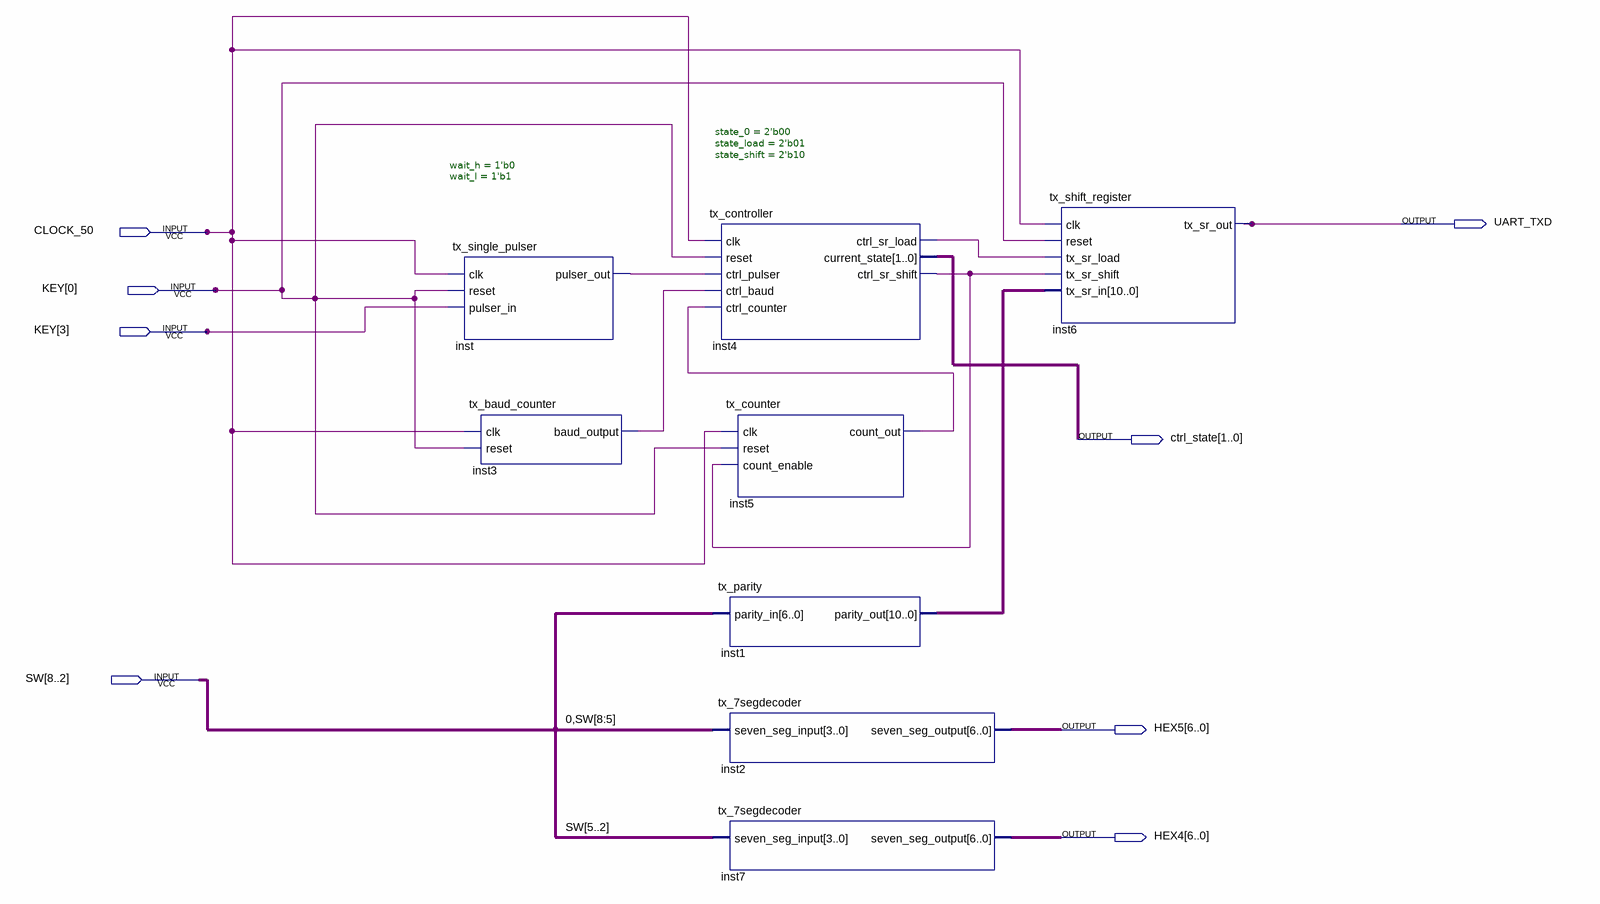
[diagram p0: schematic sheet]
// Quartus schematic tx_uart.bdf as structural Verilog: 8 symbols, 8 pins
module tx_uart (
  input  CLOCK_50,
  input  [3:0] KEY,
  input  [8:2] SW,
  output UART_TXD,
  output [1:0] ctrl_state,
  output [6:0] HEX5,
  output [6:0] HEX4
);

  wire \0 , inst3_baud_output, inst4_ctrl_sr_load, inst4_ctrl_sr_shift, inst5_count_out, inst_pulser_out;
  wire [10:0] inst1_parity_out;

  tx_single_pulser #(.wait_h(1'b0), .wait_l(1'b1)) inst (
    .clk(CLOCK_50), .reset(KEY[0]), .pulser_in(KEY[3]), .pulser_out(inst_pulser_out));
  tx_baud_counter inst3 (.clk(CLOCK_50), .reset(KEY[0]), .baud_output(inst3_baud_output));
  tx_controller #(.state_0(2'b00), .state_load(2'b01), .state_shift(2'b10)) inst4 (
    .clk(CLOCK_50), .reset(KEY[0]), .ctrl_pulser(inst_pulser_out), .ctrl_baud(inst3_baud_output),
    .ctrl_counter(inst5_count_out), .ctrl_sr_load(inst4_ctrl_sr_load), .current_state(ctrl_state),
    .ctrl_sr_shift(inst4_ctrl_sr_shift));
  tx_counter inst5 (.clk(CLOCK_50), .reset(KEY[0]), .count_enable(inst4_ctrl_sr_shift), .count_out(inst5_count_out));
  tx_parity inst1 (.parity_in(SW), .parity_out(inst1_parity_out));
  tx_7segdecoder inst2 (.seven_seg_input({\0 , SW[8:5]}), .seven_seg_output(HEX5));
  tx_7segdecoder inst7 (.seven_seg_input(SW[5:2]), .seven_seg_output(HEX4));
  tx_shift_register inst6 (
    .clk(CLOCK_50), .reset(KEY[0]), .tx_sr_load(inst4_ctrl_sr_load), .tx_sr_shift(inst4_ctrl_sr_shift),
    .tx_sr_in(inst1_parity_out), .tx_sr_out(UART_TXD));
endmodule
